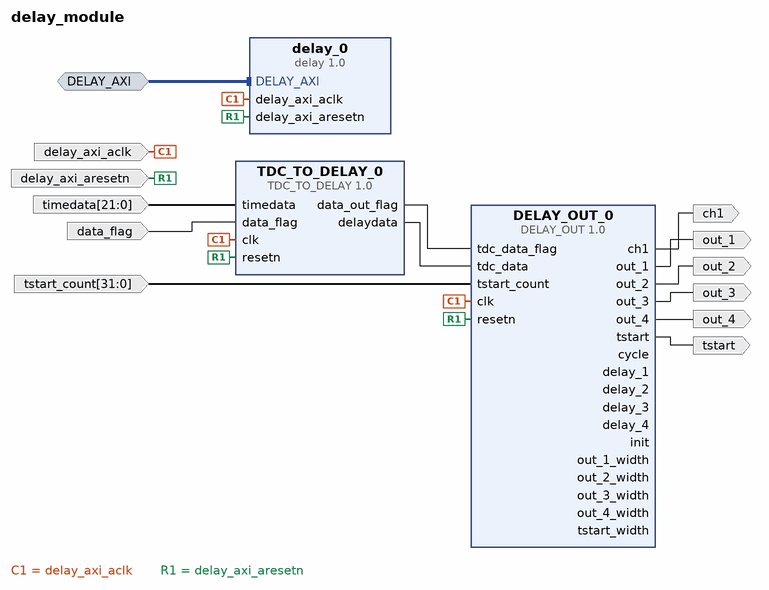
[diagram p0: block diagram of the top level]
# Vivado block design delay_module, Vivado 2016.2
create_bd_design delay_module

create_bd_intf_port -mode Slave -vlnv xilinx.com:interface:aximm_rtl:1.0 DELAY_AXI
set_property -dict [list \
  CONFIG.DATA_WIDTH 32 \
  CONFIG.PROTOCOL AXI4LITE \
  CONFIG.ID_WIDTH 0 \
  CONFIG.ADDR_WIDTH 6 \
  CONFIG.AWUSER_WIDTH 0 \
  CONFIG.ARUSER_WIDTH 0 \
  CONFIG.WUSER_WIDTH 0 \
  CONFIG.RUSER_WIDTH 0 \
  CONFIG.BUSER_WIDTH 0 \
  CONFIG.READ_WRITE_MODE READ_WRITE \
  CONFIG.HAS_BURST 0 \
  CONFIG.HAS_LOCK 0 \
  CONFIG.HAS_PROT 1 \
  CONFIG.HAS_CACHE 0 \
  CONFIG.HAS_QOS 0 \
  CONFIG.HAS_REGION 0 \
  CONFIG.HAS_WSTRB 1 \
  CONFIG.HAS_BRESP 1 \
  CONFIG.HAS_RRESP 1 \
  CONFIG.SUPPORTS_NARROW_BURST 0 \
  CONFIG.NUM_READ_OUTSTANDING 1 \
  CONFIG.NUM_WRITE_OUTSTANDING 1 \
  CONFIG.MAX_BURST_LENGTH 1 \
] [get_bd_intf_ports DELAY_AXI]
create_bd_port -dir I -type clk delay_axi_aclk
create_bd_port -dir I -type rst delay_axi_aresetn
create_bd_port -dir I -from 21 -to 0 timedata
create_bd_port -dir I data_flag
create_bd_port -dir O tstart
create_bd_port -dir O out_1
create_bd_port -dir O out_2
create_bd_port -dir O out_3
create_bd_port -dir O out_4
create_bd_port -dir O ch1
create_bd_port -dir I -from 31 -to 0 tstart_count

create_bd_cell -type ip -vlnv xilinx.com:user:TDC_TO_DELAY:1.0 TDC_TO_DELAY_0
create_bd_cell -type ip -vlnv xilinx.com:user:DELAY_OUT:1.0 DELAY_OUT_0
create_bd_cell -type ip -vlnv xilinx.com:user:delay:1.0 delay_0

# ---- connections ----

connect_bd_intf_net [get_bd_intf_ports DELAY_AXI] [get_bd_intf_pins delay_0/DELAY_AXI]
connect_bd_net [get_bd_ports delay_axi_aclk] [get_bd_pins TDC_TO_DELAY_0/clk] [get_bd_pins DELAY_OUT_0/clk] [get_bd_pins delay_0/delay_axi_aclk]
connect_bd_net [get_bd_ports delay_axi_aresetn] \
  [get_bd_pins TDC_TO_DELAY_0/resetn] [get_bd_pins DELAY_OUT_0/resetn] [get_bd_pins delay_0/delay_axi_aresetn]
# net delay_0_init_wr has one end: DELAY_OUT_0/init
connect_bd_net [get_bd_ports timedata] [get_bd_pins TDC_TO_DELAY_0/timedata]
connect_bd_net [get_bd_ports data_flag] [get_bd_pins TDC_TO_DELAY_0/data_flag]
# net delay_0_out_1_delay has one end: DELAY_OUT_0/delay_1
# net delay_0_out_2_delay has one end: DELAY_OUT_0/delay_2
# net delay_0_out_3_delay has one end: DELAY_OUT_0/delay_3
# net delay_0_out_4_delay has one end: DELAY_OUT_0/delay_4
# net delay_0_out_1_width has one end: DELAY_OUT_0/out_1_width
# net delay_0_out_2_width has one end: DELAY_OUT_0/out_2_width
# net delay_0_out_3_width has one end: DELAY_OUT_0/out_3_width
# net delay_0_out_4_width has one end: DELAY_OUT_0/out_4_width
# net delay_0_tstart_cycle has one end: DELAY_OUT_0/cycle
# net delay_0_tstart_width has one end: DELAY_OUT_0/tstart_width
connect_bd_net [get_bd_pins TDC_TO_DELAY_0/data_out_flag] [get_bd_pins DELAY_OUT_0/tdc_data_flag]
connect_bd_net [get_bd_pins TDC_TO_DELAY_0/delaydata] [get_bd_pins DELAY_OUT_0/tdc_data]
connect_bd_net [get_bd_pins DELAY_OUT_0/tstart] [get_bd_ports tstart]
connect_bd_net [get_bd_pins DELAY_OUT_0/out_1] [get_bd_ports out_1]
connect_bd_net [get_bd_pins DELAY_OUT_0/out_2] [get_bd_ports out_2]
connect_bd_net [get_bd_pins DELAY_OUT_0/out_3] [get_bd_ports out_3]
connect_bd_net [get_bd_pins DELAY_OUT_0/out_4] [get_bd_ports out_4]
connect_bd_net [get_bd_pins DELAY_OUT_0/ch1] [get_bd_ports ch1]
connect_bd_net [get_bd_ports tstart_count] [get_bd_pins DELAY_OUT_0/tstart_count]

validate_bd_design
save_bd_design
